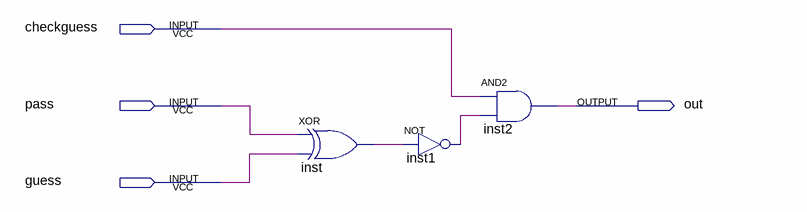
[diagram p0: schematic sheet]
// Quartus schematic smallUltimateComparers.bdf as structural Verilog: 3 symbols, 4 pins
module smallUltimateComparers (
  input  checkguess,
  input  pass,
  input  guess,
  output out
);

  wire inst1_out, inst_out;

  xor inst (inst_out, pass, guess);
  not inst1 (inst1_out, inst_out);
  and inst2 (out, checkguess, inst1_out);
endmodule
